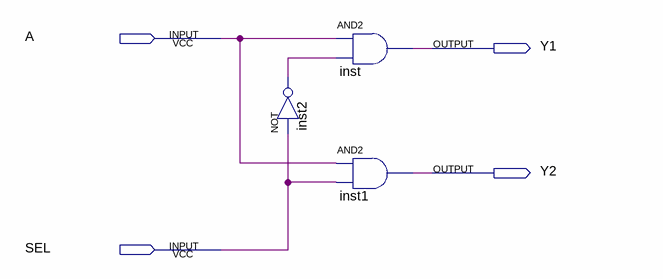
[diagram p0: schematic sheet]
// Quartus schematic DEMUX_1x2.bdf as structural Verilog: 3 symbols, 4 pins
module DEMUX_1x2 (
  input  A,
  input  SEL,
  output Y1,
  output Y2
);

  wire inst2_out;

  not inst2 (inst2_out, SEL);
  and inst (Y1, A, inst2_out);
  and inst1 (Y2, A, SEL);
endmodule
